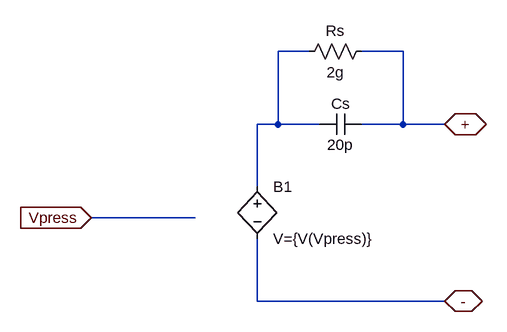
[diagram p0: schematic SENSOR_PZE_SIMPLE.asc]
SENSOR_PZE_SIMPLE.asc, the LTspice schematic file:
Version 4
SHEET 1 960 940
WIRE -176 496 -224 496
WIRE -32 496 -96 496
WIRE -224 608 -224 496
WIRE -224 608 -256 608
WIRE -160 608 -224 608
WIRE -32 608 -32 496
WIRE -32 608 -96 608
WIRE 32 608 -32 608
WIRE -256 704 -256 608
WIRE -352 752 -512 752
WIRE -256 880 -256 784
WIRE 32 880 -256 880
FLAG -512 752 Vpress
IOPIN -512 752 In
FLAG 32 608 +
IOPIN 32 608 BiDir
FLAG 32 880 -
IOPIN 32 880 BiDir
SYMBOL cap -96 592 R90
WINDOW 0 0 32 VBottom 2
WINDOW 3 32 32 VTop 2
SYMATTR InstName Cs
SYMATTR Value 20p
SYMBOL res -80 480 R90
WINDOW 0 0 56 VBottom 2
WINDOW 3 32 56 VTop 2
SYMATTR InstName Rs
SYMATTR Value 2g
SYMBOL bv -256 688 R0
SYMATTR InstName B1
SYMATTR Value V={V(Vpress)}

The netlist it stands for:
* SENSOR_PZE_SIMPLE.asc
Cs + N001 20p
Rs + N001 2g
B1 N001 - V={V(Vpress)}
.backanno
.end